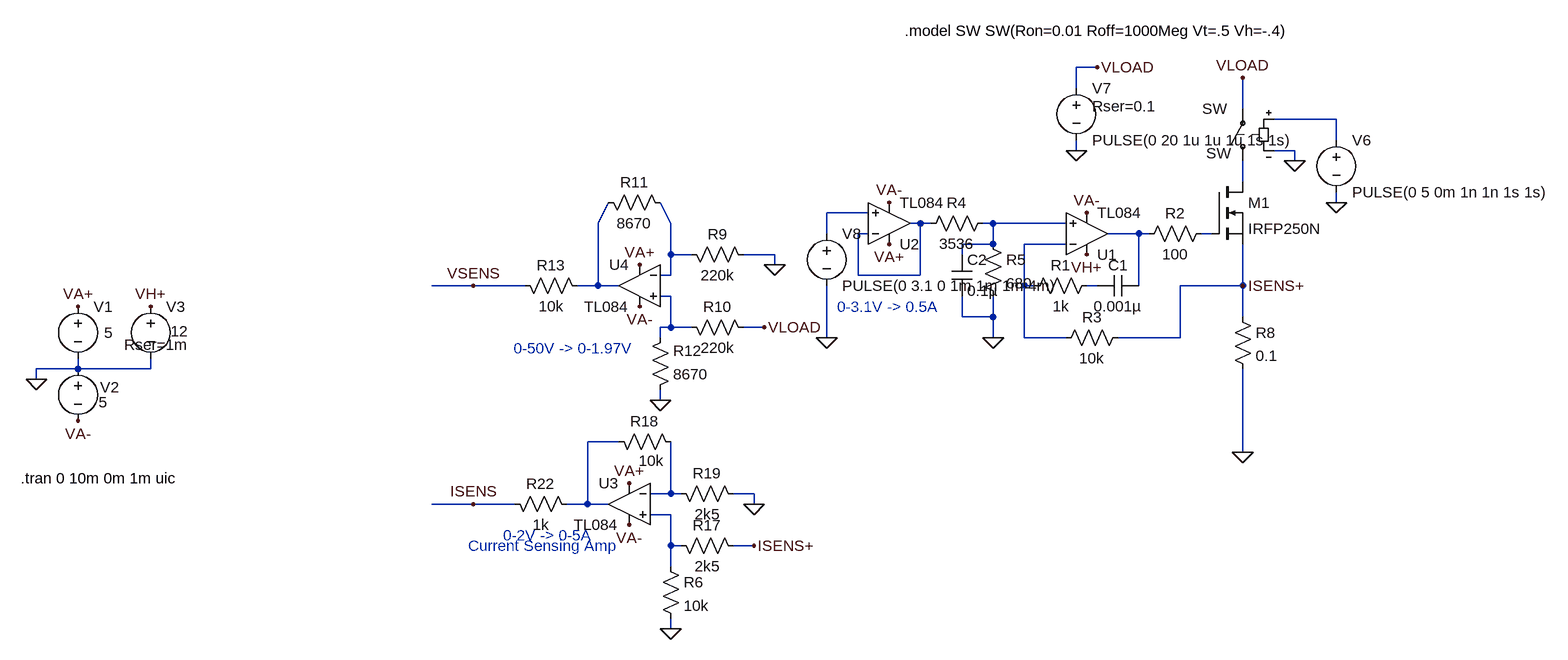
[diagram p0: schematic LTSPICE SIM.asc]
* LTSPICE SIM.asc
V1 VA+ 0 5
V2 0 VA- 5
V3 VH+ 0 12 Rser=1m
R8 ISENS+ 0 0.1
R9 N005 0 220k tol=1
R10 N012 VLOAD 220k tol=1
R11 N004 N005 8670 tol=1
R12 0 N012 8670 tol=1
R13 VSENS N004 10k
R17 N015 ISENS+ 2k5
R18 N013 N014 10k
R19 N014 0 2k5
R22 ISENS N013 1k
SW N002 VLOAD N001 0 SW
V6 N001 0 PULSE(0 5 0m 1n 1n 1s 1s)
* U3: TL084 (symbol AutoGenerated\TL084 not available, pins judged from their places): In+=N015 In-=N014 V+=VA+ V-=VA- OUT=N013
* U4: TL084 (symbol AutoGenerated\TL084 not available, pins judged from their places): In+=N012 In-=N005 V+=VA+ V-=VA- OUT=N004
V7 VLOAD 0 PULSE(0 20 1u 1u 1u 1s 1s) Rser=0.1
M1 N002 N009 ISENS+ ISENS+ IRFP250N
* U1: TL084 (symbol AutoGenerated\TL084 not available, pins judged from their places): In+=N007 In-=N010 V+=VH+ V-=VA- OUT=N008
R1 N011 N010 1k
C1 N008 N011 0.001µ V=25 Irms=0 Rser=0.0419452 Lser=448.171p mfg="Würth Elektronik" pn="885012006044 WCAP-CSGP 0603" type="NP0"
R2 N009 N008 100
R3 ISENS+ N010 10k
* U2: TL084 (symbol AutoGenerated\TL084 not available, pins judged from their places): In+=N003 In-=N006 V+=VA+ V-=VA- OUT=N006
R4 N007 N006 3536
R5 N007 0 680
C2 N007 0 0.1µ V=50 Irms=0 Rser=0 Lser=0 mfg="Murata" pn="GCM155R71H104KE02" type="X7R"
V8 N003 0 PULSE(0 3.1 0 1m 1m 1m 4m)
R6 N015 0 10k
.model NMOS NMOS
.model PMOS PMOS
.lib standard.mos
.tran 0 10m 0m 1m uic
* 0-50V -> 0-1.97V
* 0-2V -> 0-5A
.model SW SW(Ron=0.01 Roff=1000Meg Vt=.5 Vh=-.4)
* Current Sensing Amp
* 0-3.1V -> 0.5A
.backanno
.end

* Results of the author's LTspice run, read from the files saved beside the schematic
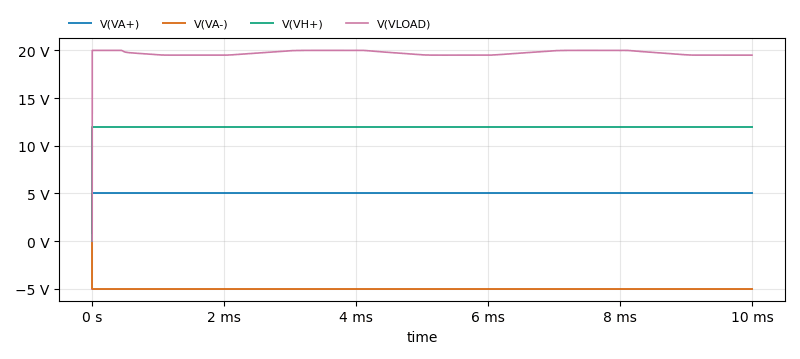
[diagram p1: Transient Analysis of LTSPICE SIM.asc, plotted from the saved traces]
* Transient Analysis, 1 run:
*   V(VA+): min 0 V, max 5 V, average 5 V, rms 5 V, last 5 V
*   V(VA-): min -5 V, max 0 V, average -5 V, rms 5 V, last -5 V
*   V(VH+): min 0 V, max 12 V, average 12 V, rms 12 V, last 12 V
*   V(VLOAD): min 0 V, max 20 V, average 19.73 V, rms 19.73 V, last 19.5 V